# Altium schematic sheet Driver.SchDoc
size A4; SheetNumber: 3; SheetTotal: 3
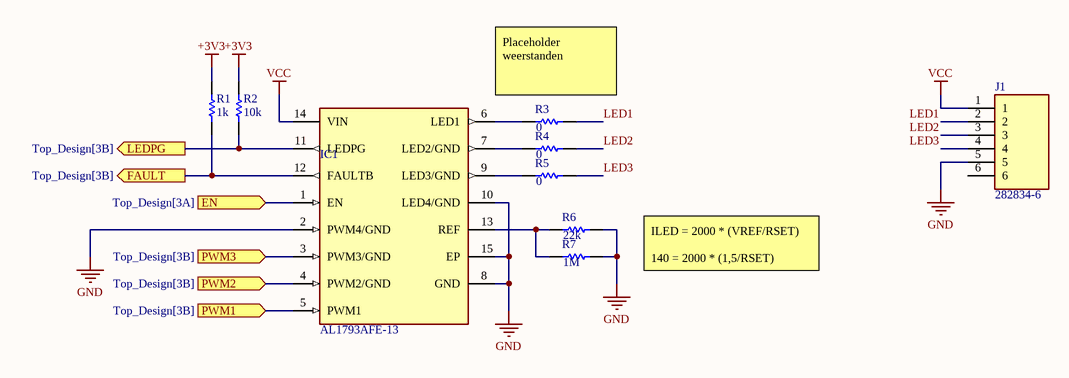
[diagram p0: Driver.SchDoc]

## Parts
IC1  AL1793AFE-13  [AL1793AFE13]
J1  282834-6  [2828346]
R1  value 1k  [RESC2013X70X40ML20T20]  (hidden comment: Resistor 1k +/-1% 0805 125 mW)
R2  value 10k  [RESC2013X70X40ML20T20]  (hidden comment: Resistor 1k +/-1% 0805 125 mW)
R3  value 0  [RESC2013X70X40ML20T20]  (hidden comment: Resistor 1k +/-1% 0805 125 mW)
R4  value 0  [RESC2013X70X40ML20T20]  (hidden comment: Resistor 1k +/-1% 0805 125 mW)
R5  value 0  [RESC2013X70X40ML20T20]  (hidden comment: Resistor 1k +/-1% 0805 125 mW)
R6  value 22k  [RESC2013X70X40ML20T20]  (hidden comment: Resistor 1k +/-1% 0805 125 mW)
R7  value 1M  [RESC2013X70X40ML20T20]  (hidden comment: Resistor 1k +/-1% 0805 125 mW)

## Ports
EN (in, see Top_Design[3A]), FAULT (out, see Top_Design[3B]), LEDPG (out, see Top_Design[3B]), PWM1 (in, see Top_Design[3B]), PWM2 (in, see Top_Design[3B]), PWM3 (in, see Top_Design[3B])

## Nets
+3V3: R1.2 R2.2
GND: IC1.2(PWM4/GND) IC1.8(GND) IC1.10(LED4/GND) IC1.15(EP) J1.5 R6.2 R7.2
VCC: IC1.14(VIN) J1.1
EN: IC1.1(EN) ; port EN
FAULT: IC1.12(FAULTB) R1.1 ; port FAULT
LED1: J1.2 R3.2
LED2: J1.3 R4.2
LED3: J1.4 R5.2
LEDPG: IC1.11(LEDPG) R2.1 ; port LEDPG
PWM1: IC1.5(PWM1) ; port PWM1
PWM2: IC1.4(PWM2/GND) ; port PWM2
PWM3: IC1.3(PWM3/GND) ; port PWM3
NetIC1_6: IC1.6(LED1) R3.1
NetIC1_7: IC1.7(LED2/GND) R4.1
NetIC1_9: IC1.9(LED3/GND) R5.1
NetIC1_13: IC1.13(REF) R6.1 R7.1

Not connected (* = marked no-connect by the designer): J1 6

## Notes on the sheet
- Placeholder weerstanden
- ILED = 2000 * (VREF/RSET)
  140 = 2000 * (1,5/RSET)

## Library data of the parts
IC1 = AL1793AFE-13: Integrated Circuit; Manufacturer_Name: Diodes Incorporated; Datasheet Link: https://www.diodes.com//assets/Datasheets/AL1791_1792_1793_1794.pdf; Height: 0.65mm; Manufacturer_Part_Number: AL1793AFE-13; Mouser Part Number: 621-AL1793AFE-13; Mouser Price/Stock: https://www.mouser.co.uk/ProductDetail/Diodes-Incorporated/AL1793AFE-13?qs=bKenfurwlskeSg5Tj2A9LQ%3D%3D; Arrow Part Number: AL1793AFE-13; Arrow Price/Stock: https://www.arrow.com/en/products/al1793afe-13/diodes-incorporated?region=nac
J1 = 282834-6: Connector; Manufacturer_Name: TE Connectivity; Datasheet Link: https://www.te.com/commerce/DocumentDelivery/DDEController?Action=srchrtrv&DocNm=1-1773458-1_EURO_STYLE_QRG&DocType=Data%20Sheet&DocLang=English&PartCntxt=282834-6&DocFormat=pdf; Height: 10.3mm; Manufacturer_Part_Number: 282834-6; Mouser Part Number: 571-282834-6; Mouser Price/Stock: https://www.mouser.co.uk/ProductDetail/TE-Connectivity/282834-6?qs=A%252Bip%252BNCYi6M0eRGalLqPCg%3D%3D; Arrow Part Number: 282834-6; Arrow Price/Stock: https://www.arrow.com/en/products/282834-6/te-connectivity?utm_currency=USD&region=nac
R1 = CMP-009-00010-5: Chip Resistor, 1 KOhm, +/- 1%, 0.125 W, -55 to 155 degC, 0805 (2013 Metric); Power: 125mW; Voltage Rating: 150V; Tolerance: 1%; RoHS Compliant: True; Mounting Technology: SM; Pins: 2; Case/Package: 0805; Max Operating Temperature: 155°C; Min Operating Temperature: -55°C
R2 = CMP-009-00010-5: Chip Resistor, 10 KOhm, +/- 1%, 0.125 W, -55 to 155 degC, 0805 (2013 Metric); Power: 125mW; Voltage Rating: 150V; Tolerance: 1%; RoHS Compliant: True; Mounting Technology: SM; Pins: 2; Case/Package: 0805; Max Operating Temperature: 155°C; Min Operating Temperature: -55°C
R3-R5 = CMP-009-00010-5: Chip Resistor, 0 Ohm, +/- 1%, 0.125 W, -55 to 155 degC, 0805 (2013 Metric); Power: 125mW; Voltage Rating: 150V; Tolerance: 1%; RoHS Compliant: True; Mounting Technology: SM; Pins: 2; Case/Package: 0805; Max Operating Temperature: 155°C; Min Operating Temperature: -55°C
R6 = CMP-009-00010-5: Chip Resistor, 22 KOhm, +/- 1%, 0.125 W, -55 to 155 degC, 0805 (2013 Metric); Power: 125mW; Voltage Rating: 150V; Tolerance: 1%; RoHS Compliant: True; Mounting Technology: SM; Pins: 2; Case/Package: 0805; Max Operating Temperature: 155°C; Min Operating Temperature: -55°C
R7 = CMP-009-00010-5: Chip Resistor, 1 MOhm, +/- 1%, 0.125 W, -55 to 155 degC, 0805 (2013 Metric); Power: 125mW; Voltage Rating: 150V; Tolerance: 1%; RoHS Compliant: True; Mounting Technology: SM; Pins: 2; Case/Package: 0805; Max Operating Temperature: 155°C; Min Operating Temperature: -55°C